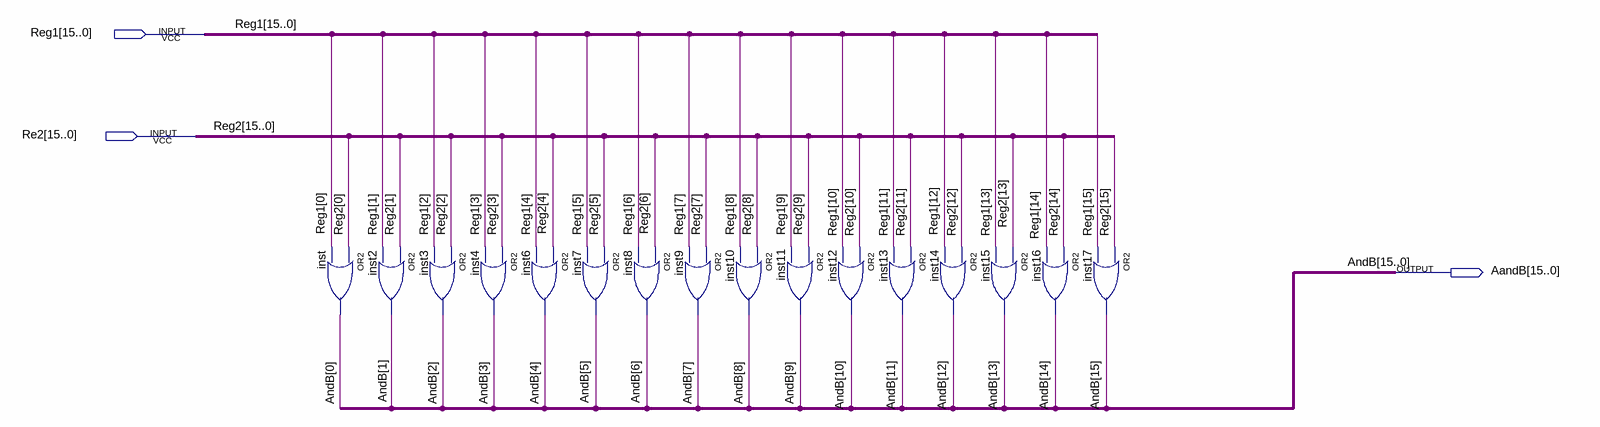
[diagram p0: schematic sheet]
// Quartus schematic 16_bit_OR.bdf as structural Verilog: 16 symbols, 3 pins
module \16_bit_OR  (
  input  [15:0] Reg1,
  input  [15:0] Re2,
  output [15:0] AandB
);

  or inst (AandB[0], Re2[0], Reg1[0]);
  or inst2 (AandB[1], Re2[1], Reg1[1]);
  or inst3 (AandB[2], Re2[2], Reg1[2]);
  or inst4 (AandB[3], Re2[3], Reg1[3]);
  or inst6 (AandB[4], Re2[4], Reg1[4]);
  or inst7 (AandB[5], Re2[5], Reg1[5]);
  or inst8 (AandB[6], Re2[6], Reg1[6]);
  or inst9 (AandB[7], Re2[7], Reg1[7]);
  or inst10 (AandB[8], Re2[8], Reg1[8]);
  or inst11 (AandB[9], Re2[9], Reg1[9]);
  or inst12 (AandB[10], Re2[10], Reg1[10]);
  or inst13 (AandB[11], Re2[11], Reg1[11]);
  or inst14 (AandB[12], Re2[12], Reg1[12]);
  or inst15 (AandB[13], Re2[13], Reg1[13]);
  or inst16 (AandB[14], Re2[14], Reg1[14]);
  or inst17 (AandB[15], Re2[15], Reg1[15]);

  // Other names for the same wires on the sheet: AndB[15:0] = AandB; Reg2[15:0] = Re2
endmodule
